# EAGLE design mini_exp_v1-1-0a (EAGLE 9.6.2)
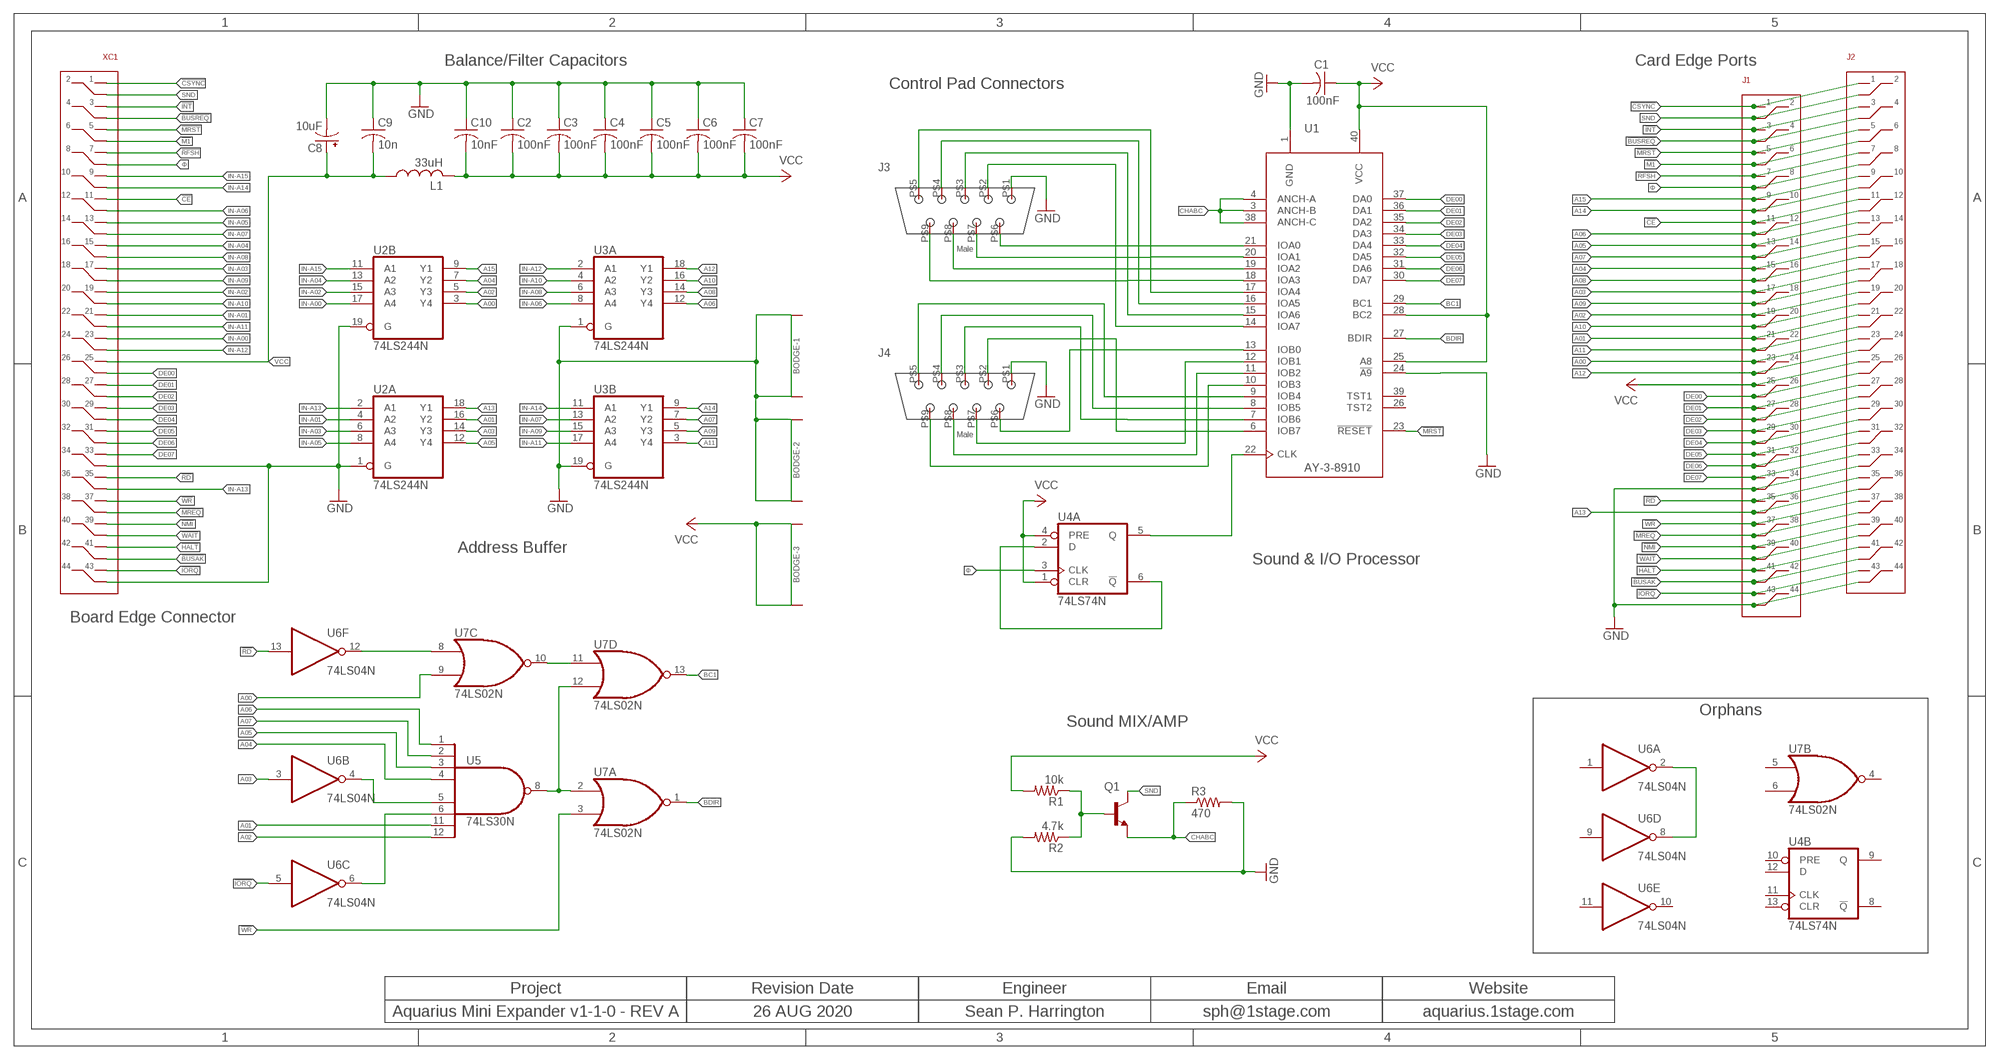
[diagram p0: schematic, sheet 1]

## Parts
C1  100nF  C-US050-025X095  [C050-025X095]
C2  100nF  C-US050-025X095  [C050-025X095]
C3  100nF  C-US050-025X095  [C050-025X095]
C4  100nF  C-US050-025X095  [C050-025X095]
C5  100nF  C-US050-025X095  [C050-025X095]
C6  100nF  C-US050-025X095  [C050-025X095]
C7  100nF  C-US050-025X095  [C050-025X095]
C8  10uF  CPOL-USE22-6AXIAL  [E22-6]
C9  10n  C-US075-032X103  [C075-032X103]
C10  10nF  C-US075-032X103  [C075-032X103]
J1  CR22A-44D-2.54DS(70)STRAIGHT  [CR22A-44D-2.54DS(70)]
J2  CR22A-44D-2.54DS(70)STRAIGHT  [CR22A-44D-2.54DS(70)]
J3  DB9-MALE-RA  [DB9-MALE-RA]
J4  DB9-MALE-RA  [DB9-MALE-RA]
L1  33uH  L-US0204/5  [0204/5]
Q1  -NPN-TO92L  [TO92L]
R1  10k  R-US_0207/7  [0207/7]
R2  4.7k  R-US_0207/7  [0207/7]
R3  470  R-US_0207/7  [0207/7]
U1  AY-3-8910  RAD38910DIL40-6  [RAD38910-DIL40-6]
U2  74LS244N  [DIL20]
U3  74LS244N  [DIL20]
U4  74LS74N  [DIL14]
U5  74LS30N  [DIL14]
U6  74LS04N  [DIL14]
U7  74LS02N  [DIL14]
XC1  AQ-CART-EDGE  [AQ-CART-EDGE]
XX01  AQ-MX-BODGE-1  [AQ-MX-BODGE-1]
XX02  AQ-MX-BODGE-2  [AQ-MX-BODGE-2]
XX03  AQ-MX-BODGE-3  [AQ-MX-BODGE-3]

## Nets
!BUSAK: J1.P$42(X42) J2.P$42(X42) XC1.P$42(X42)
!BUSREQ: J1.P$4(X4) J2.P$4(X4) XC1.P$4(X4)
!CE: J1.P$11(X11) J2.P$11(X11) XC1.P$11(X11)
!CSYNC: J1.P$1(X1) J2.P$1(X1) XC1.P$1(X1)
!HALT: J1.P$41(X41) J2.P$41(X41) XC1.P$41(X41)
!INT: J1.P$3(X3) J2.P$3(X3) XC1.P$3(X3)
!IORQ: J1.P$43(X43) J2.P$43(X43) U6.5(C:I) XC1.P$43(X43)
!M1: J1.P$6(X6) J2.P$6(X6) XC1.P$6(X6)
!MREQ: J1.P$38(X38) J2.P$38(X38) XC1.P$38(X38)
!MRST: J1.P$5(X5) J2.P$5(X5) U1.23(!RESET) XC1.P$5(X5)
!NMI: J1.P$39(X39) J2.P$39(X39) XC1.P$39(X39)
!RD: J1.P$35(X35) J2.P$35(X35) U6.13(F:I) XC1.P$35(X35)
!RFSH: J1.P$7(X7) J2.P$7(X7) XC1.P$7(X7)
!WAIT: J1.P$40(X40) J2.P$40(X40) XC1.P$40(X40)
!WR: J1.P$37(X37) J2.P$37(X37) U7.3(A:I1) XC1.P$37(X37)
A00: J1.P$23(X23) J2.P$23(X23) U2.3(B:Y4) U7.9(C:I1)
A01: J1.P$21(X21) J2.P$21(X21) U2.16(A:Y2) U5.11(I6)
A02: J1.P$19(X19) J2.P$19(X19) U2.5(B:Y3) U5.12(I7)
A03: J1.P$17(X17) J2.P$17(X17) U2.14(A:Y3) U6.3(B:I)
A04: J1.P$15(X15) J2.P$15(X15) U2.7(B:Y2) U5.4(I3)
A05: J1.P$13(X13) J2.P$13(X13) U2.12(A:Y4) U5.3(I2)
A06: J1.P$12(X12) J2.P$12(X12) U3.12(A:Y4) U5.1(I0)
A07: J1.P$14(X14) J2.P$14(X14) U3.7(B:Y2) U5.2(I1)
A08: J1.P$16(X16) J2.P$16(X16) U3.14(A:Y3)
A09: J1.P$18(X18) J2.P$18(X18) U3.5(B:Y3)
A10: J1.P$20(X20) J2.P$20(X20) U3.16(A:Y2)
A11: J1.P$22(X22) J2.P$22(X22) U3.3(B:Y4)
A12: J1.P$24(X24) J2.P$24(X24) U3.18(A:Y1)
A13: J1.P$36(X36) J2.P$36(X36) U2.18(A:Y1)
A14: J1.P$10(X10) J2.P$10(X10) U3.9(B:Y1)
A15: J1.P$9(X9) J2.P$9(X9) U2.9(B:Y1)
BC1: U1.29(BC1) U7.13(D:O)
BDIR: U1.27(BDIR) U7.1(A:O)
CHABC: Q1.1(E) R3.1 U1.3(ANCH-B) U1.4(ANCH-A) U1.38(ANCH-C)
DE00: J1.P$26(X26) J2.P$26(X26) U1.37(DA0) XC1.P$26(X26)
DE01: J1.P$27(X27) J2.P$27(X27) U1.36(DA1) XC1.P$27(X27)
DE02: J1.P$28(X28) J2.P$28(X28) U1.35(DA2) XC1.P$28(X28)
DE03: J1.P$29(X29) J2.P$29(X29) U1.34(DA3) XC1.P$29(X29)
DE04: J1.P$30(X30) J2.P$30(X30) U1.33(DA4) XC1.P$30(X30)
DE05: J1.P$31(X31) J2.P$31(X31) U1.32(DA5) XC1.P$31(X31)
DE06: J1.P$32(X32) J2.P$32(X32) U1.31(DA6) XC1.P$32(X32)
DE07: J1.P$33(X33) J2.P$33(X33) U1.30(DA7) XC1.P$33(X33)
GND: C1.2 C2.1 C3.1 C4.1 C5.1 C6.1 C7.1 C8.- C9.1 C10.1 J1.P$34(X34) J1.P$44(X44) J2.P$34(X34) J2.P$44(X44) J3.P$1 J4.P$1 R2.2 R3.2 U1.1(GND) U1.24(!A9) U2.1(A:G) U2.19(B:G) U3.1(A:G) U3.19(B:G) XC1.P$34(X34) XC1.P$44(X44) XX01.P$1 XX01.P$2 XX02.P$1 XX02.P$2
IN-A00: U2.17(B:A4) XC1.P$23(X23)
IN-A01: U2.4(A:A2) XC1.P$21(X21)
IN-A02: U2.15(B:A3) XC1.P$19(X19)
IN-A03: U2.6(A:A3) XC1.P$17(X17)
IN-A04: U2.13(B:A2) XC1.P$15(X15)
IN-A05: U2.8(A:A4) XC1.P$13(X13)
IN-A06: U3.8(A:A4) XC1.P$12(X12)
IN-A07: U3.13(B:A2) XC1.P$14(X14)
IN-A08: U3.6(A:A3) XC1.P$16(X16)
IN-A09: U3.15(B:A3) XC1.P$18(X18)
IN-A10: U3.4(A:A2) XC1.P$20(X20)
IN-A11: U3.17(B:A4) XC1.P$22(X22)
IN-A12: U3.2(A:A1) XC1.P$24(X24)
IN-A13: U2.2(A:A1) XC1.P$36(X36)
IN-A14: U3.11(B:A1) XC1.P$10(X10)
IN-A15: U2.11(B:A1) XC1.P$9(X9)
N$5: Q1.2(B) R1.1 R2.1
N$6: U6.2(A:O) U6.8(D:O)
N$18: J4.P$6 U1.13(IOB0)
N$62: U7.10(C:O) U7.11(D:I0)
N$63: U4.2(A:D) U4.6(A:!Q)
N$89: U1.22(CLK) U4.5(A:Q)
N$90: U5.8(O) U7.2(A:I0) U7.12(D:I1)
N$91: U6.12(F:O) U7.8(C:I0)
N$92: U5.5(I4) U6.4(B:O)
N$93: U5.6(I5) U6.6(C:O)
N$94: J4.P$2 U1.6(IOB7)
N$95: J4.P$7 U1.12(IOB1)
N$96: J4.P$8 U1.11(IOB2)
N$98: J4.P$5 U1.9(IOB4)
N$99: J4.P$4 U1.8(IOB5)
N$100: J4.P$3 U1.7(IOB6)
N$101: J4.P$9 U1.10(IOB3)
N$102: J3.P$2 U1.14(IOA7)
N$103: J3.P$3 U1.15(IOA6)
N$104: J3.P$4 U1.16(IOA5)
N$105: J3.P$5 U1.17(IOA4)
N$106: J3.P$6 U1.21(IOA0)
N$107: J3.P$7 U1.20(IOA1)
N$108: J3.P$8 U1.19(IOA2)
N$109: J3.P$9 U1.18(IOA3)
SND: J1.P$2(X2) J2.P$2(X2) Q1.3(C) XC1.P$2(X2)
VCC: C1.1 C2.2 C3.2 C4.2 C5.2 C6.2 C7.2 C8.+ C9.2 C10.2 J1.P$25(X25) J2.P$25(X25) L1.1 L1.2 R1.2 U1.25(A8) U1.28(BC2) U1.40(VCC) U4.1(A:CLR) U4.4(A:PRE) XC1.P$25(X25) XX03.P$1 XX03.P$2
Φ: J1.P$8(X8) J2.P$8(X8) U4.3(A:CLK) XC1.P$8(X8)
Unconnected: U1.26(TST2) U1.39(TST1) U4.8(B:!Q) U4.9(B:Q) U4.10(B:PRE) U4.11(B:CLK) U4.12(B:D) U4.13(B:CLR) U6.1(A:I) U6.9(D:I) U6.10(E:O) U6.11(E:I) U7.4(B:O) U7.5(B:I0) U7.6(B:I1)

## Notes on the sheet
- Balance/Filter Capacitors | Card Edge Ports
- Control Pad Connectors
- Address Buffer
- Sound & I/O Processor
- Board Edge Connector
- Orphans
- Sound MIX/AMP
- Project | Revision Date | Engineer | Email | Website
- Aquarius Mini Expander v1-1-0 - REV A | 26 AUG 2020 | Sean P. Harrington | sph@1stage.com | aquarius.1stage.com

## Power pins joined to a net without a drawn wire
GND: U2.10(P:GND) U3.10(P:GND) U4.7(P:GND) U5.7(GND) U6.7(P:GND) U7.7(P:GND)
VCC: U2.20(P:VCC) U3.20(P:VCC) U4.14(P:VCC) U5.14(VCC) U6.14(P:VCC) U7.14(P:VCC)

## Library data of the parts
C1-C7 = aq-rcl:C-US: CAPACITOR, American symbol
C8 = aq-rcl:CPOL-US: POLARIZED CAPACITOR, American symbol; SPICEPREFIX: C
C9 C10 = aq-rcl:C-US: CAPACITOR, American symbol; SPICEPREFIX: C
J1 J2 = con-hirose-sph:CR22A-44D-2.54DS(70)
J3 J4 = aquarius:DB9-MALE-RA
L1 = aq-rcl:L-US: INDUCTOR, American symbol; SPICEPREFIX: L
Q1 = aq-transistor:*-NPN-: NPN Transistror BF959 corrected 2008.03.06
R1-R3 = aq-rcl:R-US_: RESISTOR, American symbol; SPICEPREFIX: R
U1 = aquarius:RAD38910
U2 U3 = 74xx-us:74*244: Octal BUFFER and LINE DRIVER, 3-state
U4 = 74xx-us:74*74: Dual D type positive edge triggered FLIP FLOP, preset and clear
U5 = 74xx-us:74*30: 8-input NAND gate
U6 = 74xx-us:74*04: Hex INVERTER
U7 = 74xx-us:74*02: Quad 2-input NOR gate
XC1 = aquarius:AQ-CART-EDGE
XX01 = aquarius:AQ-MX-BODGE-1
XX02 = aquarius:AQ-MX-BODGE-2
XX03 = aquarius:AQ-MX-BODGE-3

## Board
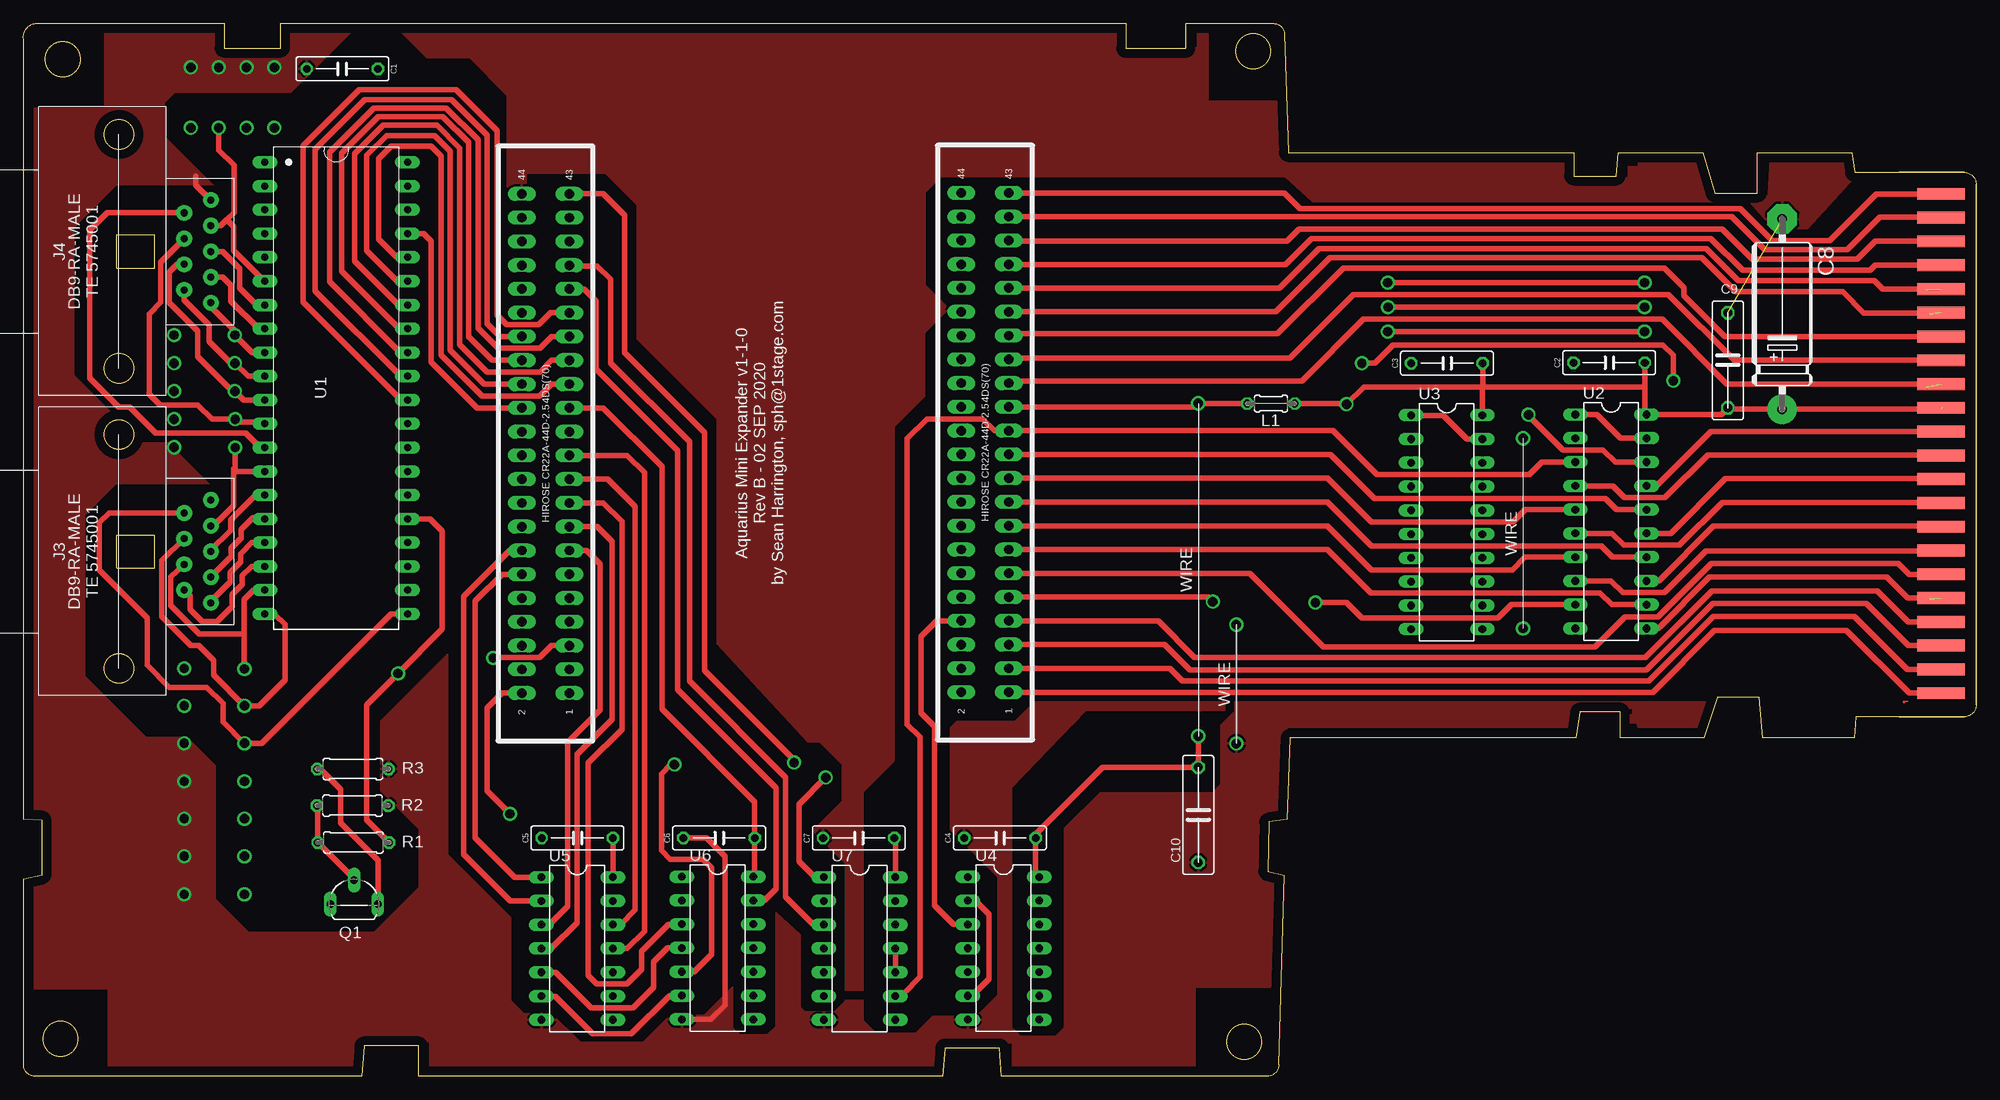
[diagram p1: board, top side]
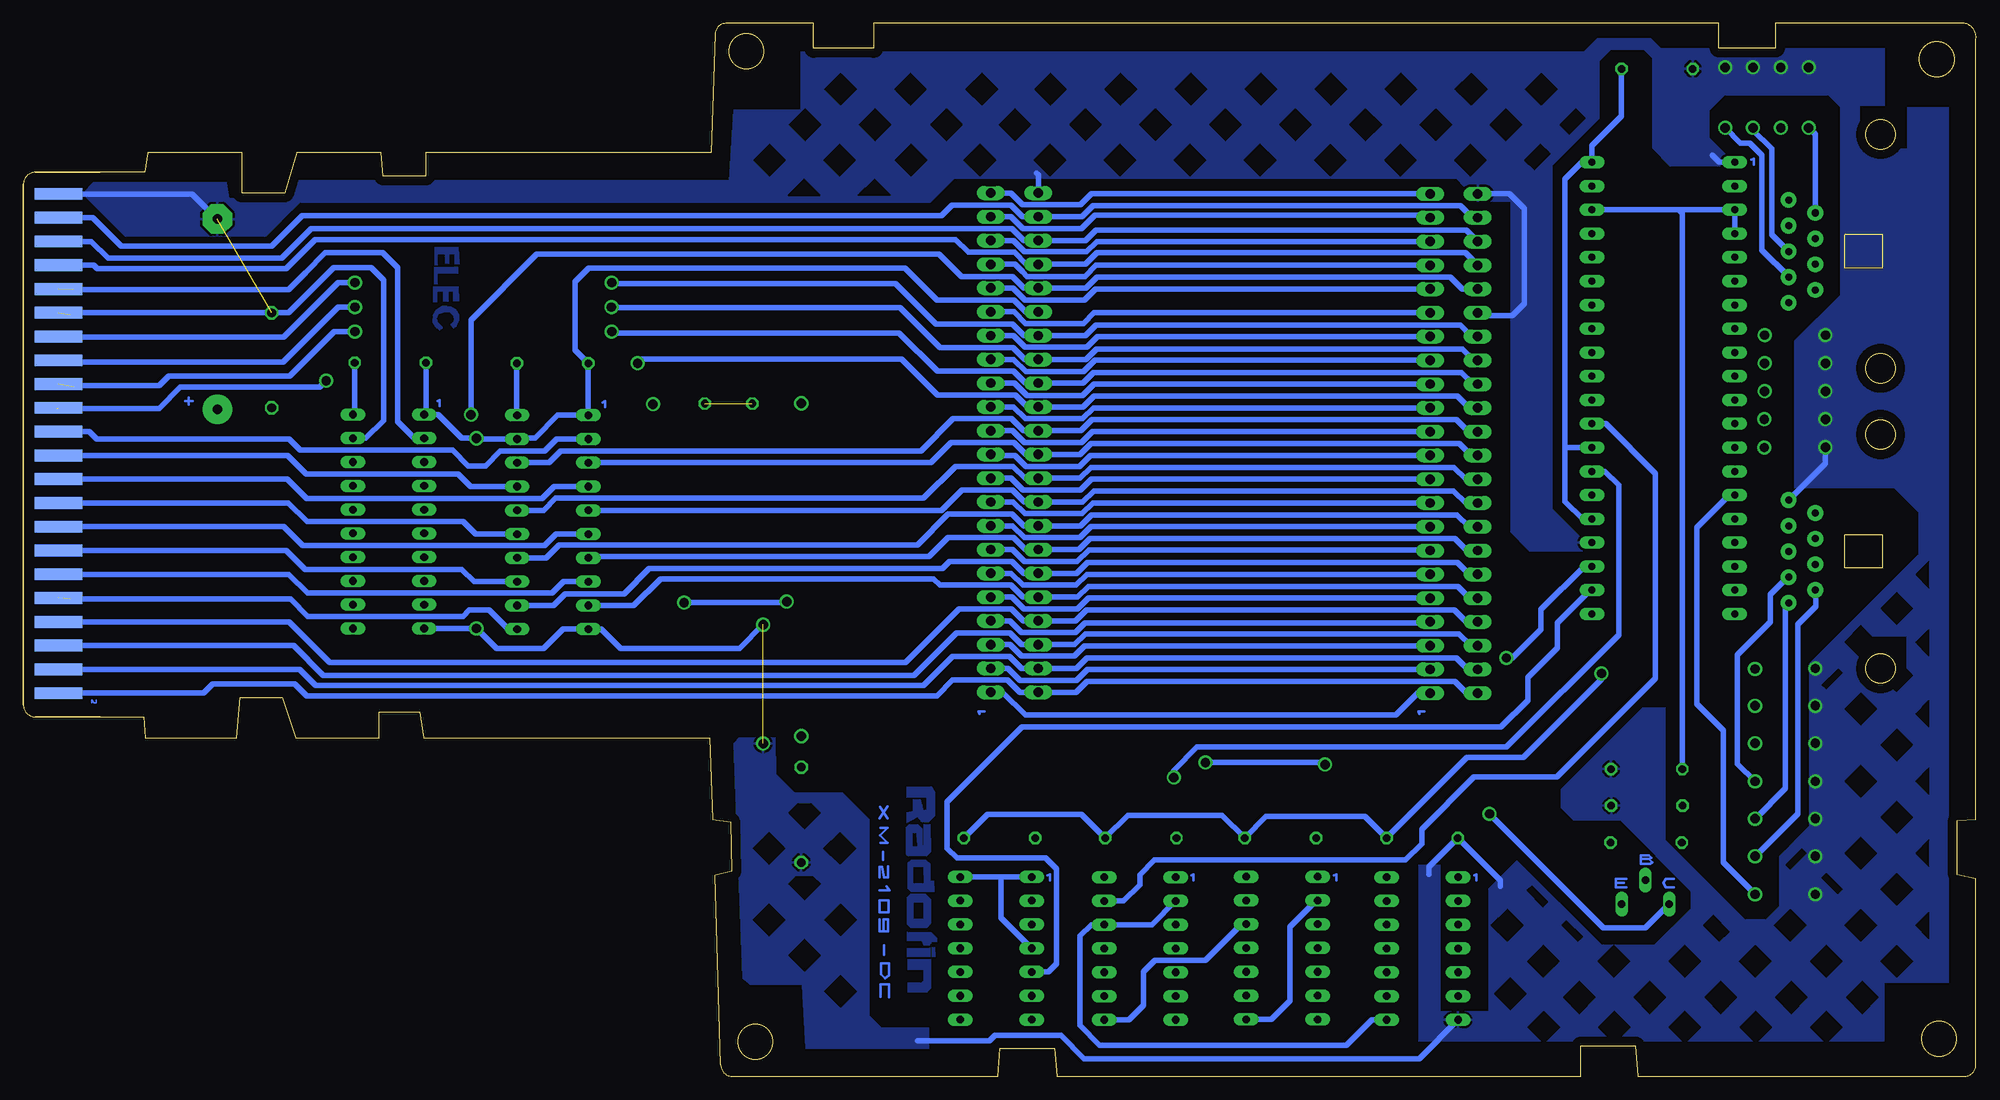
[diagram p2: board, bottom side, seen from below]

Size 208.57 x 112.5 mm. Coordinates in mm from the lower left corner, seen from the top.
Outline: 195.31,98.7 195.59,96.6 207.3,96.6 arc-90 208.57,95.33 208.57,39.67 arc-90 207.3,38.41 195.72,38.41 195.57,36.14 185.81,36.14 185.43,40.49 180.91,40.49 179.51,36.14 170.55,36.14 170.55,38.91 166.23,38.91 165.82,36.14 135.29,36.14 134.94,27.46 133.03,27.18 132.9,21.92 134.68,21.49 134.1,1.27 arc-90 132.83,0 104.46,0 104.28,3.02 98.44,3.02 98.16,0 42.2,0 42.2,3.25 36.38,3.25 36.13,0 1.28,0 arc-90 0.01,1.27 0.01,21.13 1.99,21.54 1.99,27.36 0.01,27.48 0.01,110.85 arc-90 1.28,112.5 21.42,112.5 21.42,109.86 27.47,109.86 27.47,112.5 117.77,112.5 117.77,109.83 124.17,109.83 124.17,112.5 133.44,112.5 arc-90 134.71,111.35 135.11,98.7 165.59,98.7 165.59,96.19 170.14,96.19 170.37,98.7 179.39,98.7 180.68,94.39 185.23,94.39 185.23,98.7 195.31,98.7
Outline: circle at 3.95,4.01 radius 1.86
Outline: circle at 4.2,108.66 radius 1.86
Outline: circle at 131.35,109.52 radius 1.86
Outline: circle at 130.39,3.71 radius 1.86
Outline: circle at 10.2,100.63 radius 1.57
Outline: circle at 10.2,75.64 radius 1.57
Outline: circle at 10.2,68.58 radius 1.57
Outline: circle at 10.2,43.59 radius 1.57
Copper layers (1*16): Top 0.035mm / dielectric 1.5mm / Bottom 0.035mm
Design rules "default": minimum track width 6mil, minimum drill 0.35mm, track to track 6mil, track to pad 6mil, pad to pad 6mil, via to via 6mil, smd to smd 6mil, copper to edge 40mil, drill to drill 6mil, minimum pad ring 10mil, minimum via ring 8mil, stop-mask expansion 4mil, vias tented up to drill 0mil, thermal gap 10mil

### Footprints (pad centres in the part's own frame; a part is rotated, then mirrored left to right if it is on the bottom)
C050-025X095 = drill 0.813 octagon: 1 -3.81,0; 2 3.81,0
E22-6 = drill 1.016 pad 3.15: + -11.43,0 | drill 1.016 pad 3.15 octagon: - 8.89,0
C075-032X103 = drill 0.914 octagon: 1 -5.08,0; 2 5.08,0
CR22A-44D-2.54DS(70) = drill 1 pad 1.422 long: P$1 -26.67,-2.54; P$2 -26.67,2.54; P$3 -24.13,-2.54; P$4 -24.13,2.54; P$5 -21.59,-2.54; P$6 -21.59,2.54; P$7 -19.05,-2.54; P$8 -19.05,2.54; P$9 -16.51,-2.54; P$10 -16.51,2.54; P$11 -13.97,-2.54; P$12 -13.97,2.54; P$13 -11.43,-2.54; P$14 -11.43,2.54; P$15 -8.89,-2.54; P$16 -8.89,2.54; P$17 -6.35,-2.54; P$18 -6.35,2.54; P$19 -3.81,-2.54; P$20 -3.81,2.54; P$21 -1.27,-2.54; P$22 -1.27,2.54; P$23 1.27,-2.54; P$24 1.27,2.54; P$25 3.81,-2.54; P$26 3.81,2.54; P$27 6.35,-2.54; P$28 6.35,2.54; P$29 8.89,-2.54; P$30 8.89,2.54; P$31 11.43,-2.54; P$32 11.43,2.54; P$33 13.97,-2.54; P$34 13.97,2.54; P$35 16.51,-2.54; P$36 16.51,2.54; P$37 19.05,-2.54; P$38 19.05,2.54; P$39 21.59,-2.54; P$40 21.59,2.54; P$41 24.13,-2.54; P$42 24.13,2.54; P$43 26.67,-2.54; P$44 26.67,2.54
DB9-MALE-RA = drill 0.75 pad 1.676: P$1 5.537,-9.83; P$2 2.794,-9.83; P$3 0.051,-9.83; P$4 -2.692,-9.83; P$5 -5.436,-9.83; P$6 4.166,-6.985; P$7 1.422,-6.985; P$8 -1.321,-6.985; P$9 -4.064,-6.985
0204/5 = drill 0.813 octagon: 1 -2.54,0; 2 2.54,0
TO92L = drill 0.813 long: 1 0,-2.54; 2 2.54,0; 3 0,2.54
0207/7 = drill 0.813 octagon: 1 -3.81,0; 2 3.81,0
RAD38910-DIL40-6 = drill 0.743 pad 1.343 long: 1 -7.62,24.13; 2 -7.62,21.59; 3 -7.62,19.05; 4 -7.62,16.51; 5 -7.62,13.97; 6 -7.62,11.43; 7 -7.62,8.89; 8 -7.62,6.35; 9 -7.62,3.81; 10 -7.62,1.27; 11 -7.62,-1.27; 12 -7.62,-3.81; 13 -7.62,-6.35; 14 -7.62,-8.89; 15 -7.62,-11.43; 16 -7.62,-13.97; 17 -7.62,-16.51; 18 -7.62,-19.05; 19 -7.62,-21.59; 20 -7.62,-24.13; 21 7.62,-24.13; 22 7.62,-21.59; 23 7.62,-19.05; 24 7.62,-16.51; 25 7.62,-13.97; 26 7.62,-11.43; 27 7.62,-8.89; 28 7.62,-6.35; 29 7.62,-3.81; 30 7.62,-1.27; 31 7.62,1.27; 32 7.62,3.81; 33 7.62,6.35; 34 7.62,8.89; 35 7.62,11.43; 36 7.62,13.97; 37 7.62,16.51; 38 7.62,19.05; 39 7.62,21.59; 40 7.62,24.13
DIL20 = drill 0.813 long: 1 -11.43,-3.81; 2 -8.89,-3.81; 3 -6.35,-3.81; 4 -3.81,-3.81; 5 -1.27,-3.81; 6 1.27,-3.81; 7 3.81,-3.81; 8 6.35,-3.81; 9 8.89,-3.81; 10 11.43,-3.81; 11 11.43,3.81; 12 8.89,3.81; 13 6.35,3.81; 14 3.81,3.81; 15 1.27,3.81; 16 -1.27,3.81; 17 -3.81,3.81; 18 -6.35,3.81; 19 -8.89,3.81; 20 -11.43,3.81
DIL14 = drill 0.813 long: 1 -7.62,-3.81; 2 -5.08,-3.81; 3 -2.54,-3.81; 4 0,-3.81; 5 2.54,-3.81; 6 5.08,-3.81; 7 7.62,-3.81; 8 7.62,3.81; 9 5.08,3.81; 10 2.54,3.81; 11 0,3.81; 12 -2.54,3.81; 13 -5.08,3.81; 14 -7.62,3.81
AQ-CART-EDGE = smd 5.08 x 1.27: P$1 -1.905,-26.67; P$3 -1.905,-24.13; P$5 -1.905,-21.59; P$7 -1.905,-19.05; P$9 -1.905,-16.51; P$11 -1.905,-13.97; P$13 -1.905,-11.43; P$15 -1.905,-8.89; P$17 -1.905,-6.35; P$19 -1.905,-3.81; P$21 -1.905,-1.27; P$23 -1.905,1.27; P$25 -1.905,3.81; P$27 -1.905,6.35; P$29 -1.905,8.89; P$31 -1.905,11.43; P$33 -1.905,13.97; P$35 -1.905,16.51; P$37 -1.905,19.05; P$39 -1.905,21.59; P$41 -1.905,24.13; P$43 -1.905,26.67 | smd 5.08 x 1.27 bottom: P$2 -1.905,-26.67; P$4 -1.905,-24.13; P$6 -1.905,-21.59; P$8 -1.905,-19.05; P$10 -1.905,-16.51; P$12 -1.905,-13.97; P$14 -1.905,-11.43; P$16 -1.905,-8.89; P$18 -1.905,-6.35; P$20 -1.905,-3.81; P$22 -1.905,-1.27; P$24 -1.905,1.27; P$26 -1.905,3.81; P$28 -1.905,6.35; P$30 -1.905,8.89; P$32 -1.905,11.43; P$34 -1.905,13.97; P$36 -1.905,16.51; P$38 -1.905,19.05; P$40 -1.905,21.59; P$42 -1.905,24.13; P$44 -1.905,26.67
AQ-MX-BODGE-1 = drill 1 pad 1.295: P$1 0,10.16; P$2 0,-10.16
AQ-MX-BODGE-2 = drill 1 pad 1.295: P$1 0,7.62; P$2 0,-5.08
AQ-MX-BODGE-3 = drill 1 pad 1.295: P$1 0,17.78; P$2 0,-17.78

### Placement (x,y rotation side)
C1  34.07,107.65 180 top
C2  169.38,76.25 0 top
C3  152.06,76.2 0 top
C4  104.3,25.48 0 top
C5  59.17,25.48 0 top
C6  74.31,25.48 0 top
C7  89.22,25.48 0 top
C8  187.87,82.7 90 top
C9  182.05,76.5 270 top
C10  125.49,27.94 90 top
J1  102.7,67.72 90 top
J2  55.76,67.61 90 top
J3  10.2,56.03 90 top
J4  10.2,88.09 90 top
L1  133.26,71.88 180 top
Q1  35.32,18.41 90 top
R1  35.24,24.99 0 top
R2  35.16,28.93 0 top
R3  35.19,32.84 0 top
U1  33.41,73.53 0 top
U2  169.58,59.28 270 top
U3  152.03,59.21 270 top
U4  104.68,13.69 270 top
U5  59.14,13.67 270 top
U6  74.15,13.72 270 top
U7  89.32,13.67 270 top
XC1  206.74,67.61 0 top
XX01  160.18,58.01 0 top
XX02  129.55,40.64 0 top
XX03  125.49,54.13 0 top

### Tracks (layer width: path | path; a pad name or v marks a point on that pad's centre or on a via)
!BUSAK
  Bottom 0.61: J2.P$42 53.81,91.75 55.08,93.02 94.32,93.02 95.49,91.85 J1.P$42 101.87,91.85 103.11,93.09 109.36,93.09 110.5,91.95 178.78,91.95 182.03,88.7 198.11,88.7 201.15,91.75 XC1.P$42
!BUSREQ
  Bottom 0.61: J2.P$4 54.27,43.48 55.51,44.73 94.96,44.73 96.1,43.59 J1.P$4 101.97,43.59 103.24,44.86 109.33,44.86 112.43,41.76 177.35,41.76 179.08,43.48 XC1.P$4
!CE
  Top 0.61: XC1.P$11 201.41,53.65 200.24,54.81 180.28,54.81 174.57,49.1 171.03,49.1 167.83,45.9 138.87,45.9 131.02,53.75 J1.P$11
  Bottom 0.61: J1.P$11 103.06,53.75 101.79,52.48 96.13,52.48 94.96,53.65 J2.P$11
!CSYNC
  Top 0.61: J1.P$1 174.04,41.05 180.61,47.62 194.73,47.62 201.41,40.95 XC1.P$1
  Bottom 0.61: J2.P$1 59.63,40.95 61.96,38.61 101.54,38.61 103.97,41.05 J1.P$1
!HALT
  Top 0.61: XC1.P$41 204.15,91.8 198.28,91.8 194.8,88.32 186.02,88.32 182.49,91.85 J1.P$41
  Bottom 0.61: J2.P$41 58.58,92.02 94.12,92.02 95.57,90.58 101.81,90.58 103.08,91.85 J1.P$41
!INT
  Top 0.61: XC1.P$3 201.2,43.48 195.57,49.12 180.53,49.12 173.63,42.23 123.82,42.23 122.46,43.59 J1.P$3
  Bottom 0.61: J1.P$3 103.39,43.59 102.12,42.32 96.1,42.32 94.93,43.48 J2.P$3
!IORQ  (via drill 1 pad 1.3)
  Top 0.61: XC1.P$43 204.18,94.26 197.9,94.26 192.92,89.28 186.83,89.28 183.4,92.71 136.36,92.71 134.68,94.39 J1.P$43 | J2.P$43 61.94,94.28 64.22,92 64.22,77.34 72.78,68.78 72.78,43.36 82.31,33.83 v82.31,33.53 | v69.53,33.33 69.15,33.33 68.16,32.33 68.16,24.13 69.1,23.19 72.6,23.19 73.52,22.28 73.52,13.06 71.64,11.18 U6.5
  Bottom 0.61: v82.31,33.53 69.73,33.53 v69.53,33.33 | J2.P$43 94.5,94.28 95.67,93.12 101.84,93.12 103.11,94.39 J1.P$43
!M1
  Bottom 0.61: J2.P$6 53.99,46.02 55.23,47.27 95.13,47.27 96.28,46.13 J1.P$6 101.94,46.13 103.21,47.4 108.9,47.4 113.45,42.85 176.54,42.85 179.72,46.02 XC1.P$6
!MREQ
  Bottom 0.61: J2.P$38 54.55,87.99 93.92,87.99 95.13,86.77 J1.P$38 101.46,86.77 102.73,88.04 107.63,88.04 109,89.41 177.41,89.41 180.53,86.28 200.7,86.28 201.08,86.67 XC1.P$38
!MRST  (via drill 1 pad 1.3)
  Top 0.61: XC1.P$5 201.33,46.02 196.84,50.52 180.45,50.52 173.34,43.41 124.6,43.41 121.88,46.13 J1.P$5 | J2.P$5 56.4,46.02 55.15,44.78 50.25,44.78 v50.18,44.7
  Bottom 0.61: U1.23 41.85,54.48 46.47,49.86 46.47,47.75 49.52,44.7 v50.18,44.7 | J1.P$5 103.19,46.13 101.97,44.91 96.33,44.91 95.24,46 58.33,46 J2.P$5
!NMI
  Top 0.61: J1.P$39 105.29,89.26 134.96,89.26 136.23,90.53 181.44,90.53 184.67,87.3 195.9,87.3 197.83,89.23 204.18,89.23 XC1.P$39
  Bottom 0.61: J2.P$39 93.92,89.2 95.02,88.09 101.62,88.09 102.83,89.31 J1.P$39
!RD
  Top 0.61: XC1.P$35 198.6,84.12 197.71,85.01 183.17,85.01 179.74,88.44 138.39,88.44 134.15,84.2 105.27,84.2 J1.P$35 | J2.P$35 59.88,84.12 61.15,82.86 61.15,75.59 69.86,66.88 69.86,41.35 80.38,30.84 80.38,20.02 79.16,18.8 U6.13
  Bottom 0.61: J2.P$35 94.04,84.12 95.24,82.93 101.59,82.93 102.88,84.23 J1.P$35
!RFSH
  Top 0.61: XC1.P$7 201.33,48.56 198.03,51.87 180.35,51.87 173.26,44.78 125.11,44.78 121.22,48.67 J1.P$7
  Bottom 0.61: J1.P$7 103.19,48.67 101.97,47.45 96.18,47.45 95.16,48.46 58.41,48.46 J2.P$7
!WAIT
  Bottom 0.61: J2.P$40 54.44,90.42 93.99,90.42 95.11,89.31 J1.P$40 101.69,89.31 102.96,90.58 177.84,90.58 180.99,87.43 199.53,87.43 201.31,89.2 XC1.P$40
!WR
  Top 0.61: XC1.P$37 197.83,86.67 197.29,86.13 183.64,86.13 180.26,89.51 137.55,89.51 134.78,86.74 105.27,86.74 J1.P$37 | J2.P$37 58.38,86.59 61.3,86.59 62.72,85.17 62.72,76.22 71.13,67.82 71.13,42.24 81.42,31.95 81.42,19.2 84.42,16.2 U7.3
  Bottom 0.61: J2.P$37 93.99,86.67 95.19,85.47 101.38,85.47 101.87,85.95 101.87,86 102.63,86.77 J1.P$37
A00
  Top 0.61: U2.3 162.17,65.63 160.84,64.31 144.56,64.31 139.89,68.99 J1.P$23 103.72,68.99 102.46,70.25 96.5,70.25 94.4,68.15 94.4,37.62 95.77,36.25 95.77,10.62 94.04,8.89 93.43,8.89 U7.9
  Bottom 0.61: J2.P$23 94.4,68.89 95.57,67.72 101.64,67.72 102.91,68.99 J1.P$23
A01
  Top 0.61: U2.16 170.17,60.55 168.97,61.75 144.28,61.75 139.58,66.45 J1.P$21 | J2.P$21 64.48,66.34 66.33,64.49 66.33,15.49 64.5,13.66 U5.11
  Bottom 0.61: J1.P$21 105.12,66.32 102.65,66.32 101.48,65.15 95.79,65.15 94.6,66.34 J2.P$21
A02
  Top 0.61: J2.P$19 62.39,63.8 65.34,60.86 65.34,17.78 63.77,16.2 U5.12 | U2.5 160.44,60.55 159.12,59.23 143.98,59.23 139.31,63.91 J1.P$19
  Bottom 0.61: J2.P$19 94.47,63.8 95.64,62.64 101.79,62.64 103.06,63.91 J1.P$19
A03
  Top 0.61: U2.14 169.73,55.47 168.54,56.67 144,56.67 139.31,61.37 J1.P$17 | J2.P$17 61.94,61.27 63.94,59.26 63.94,37.08 60.34,33.48 60.34,10.79 61.25,9.88 64.5,9.88 66.05,11.43 66.05,13.39 68.92,16.26 U6.3
  Bottom 0.61: J2.P$17 94.35,61.27 95.49,60.12 101.61,60.12 102.86,61.37 J1.P$17
A04
  Top 0.61: U2.7 160.39,55.47 159.04,54.13 144,54.13 139.31,58.83 J1.P$15 | J2.P$15 61.28,58.73 62.88,57.12 62.88,38.12 59.14,34.39 59.14,16.43 56.37,13.66 U5.4
  Bottom 0.61: J2.P$15 58.33,58.75 94.52,58.75 95.72,57.56 101.64,57.56 102.91,58.83 J1.P$15
A05
  Top 0.61: U2.12 169.66,50.39 168.39,51.66 143.93,51.66 139.31,56.29 J1.P$13 | J2.P$13 60.16,56.19 61.58,54.76 61.58,39.13 58.15,35.7 58.15,18.19 56.17,16.2 U5.3
  Bottom 0.61: J1.P$13 102.93,56.29 101.66,55.02 96.02,55.02 94.78,56.26 58.38,56.26 J2.P$13
A06
  Top 0.61: U5.1 52.49,21.29 48.27,25.5 48.27,50.8 51.12,53.65 J2.P$12
  Bottom 0.61: U3.12 151.93,50.32 150.68,51.56 144.41,51.56 141.72,54.25 110.4,54.25 109.64,55.02 102.98,55.02 101.71,53.75 J1.P$12 96.07,53.75 94.91,54.91 55.38,54.91 54.11,53.65 J2.P$12
A07
  Top 0.61: U5.2 52.01,18.75 47,23.75 47,51.26 51.93,56.19 J2.P$14
  Bottom 0.61: J2.P$14 54.39,56.19 55.69,57.48 94.64,57.48 95.83,56.29 J1.P$14 101.54,56.29 102.81,57.56 109.82,57.56 111.85,55.52 148.09,55.52 U3.7
A08
  Bottom 0.61: J2.P$16 54.16,58.73 55.43,59.99 94.5,59.99 95.67,58.83 J1.P$16 101.69,58.83 102.96,60.1 109.79,60.1 113.09,56.79 151.34,56.79 152.74,55.4 U3.14
A09
  Bottom 0.61: J2.P$18 54.52,61.27 55.82,62.56 94.25,62.56 95.44,61.37 J1.P$18 101.66,61.37 102.93,62.64 108.33,62.64 110.49,60.48 U3.5
A10
  Bottom 0.61: J2.P$20 54.52,63.8 55.79,65.08 94.52,65.08 95.69,63.91 J1.P$20 101.61,63.91 102.88,65.18 109,65.18 112.41,61.77 151.7,61.77 153,60.48 U3.16
A11
  Bottom 0.61: J2.P$22 53.91,66.34 55.18,67.61 94.55,67.61 95.72,66.45 J1.P$22 101.48,66.45 102.75,67.72 109.49,67.72 111.64,65.56 U3.3
A12
  Bottom 0.61: J2.P$24 54.24,68.89 55.51,70.16 94.45,70.16 95.62,68.99 J1.P$24 101.74,68.99 103.01,70.26 109.26,70.26 112.71,66.8 151.17,66.8 152.41,65.56 U3.18
A13  (via drill 1 pad 1.3)
  Top 0.61: U2.18 170.01,65.63 168.72,66.93 164.45,66.93 160.77,70.61 v160.77,70.69
  Bottom 0.61: J2.P$36 54.88,84.12 56.15,85.39 93.89,85.39 95.06,84.23 J1.P$36 101.69,84.23 102.93,85.47 108.39,85.47 110.76,87.83 153.73,87.83 160.77,80.8 v160.77,70.69
A14
  Bottom 0.61: J2.P$10 54.11,51.1 55.36,52.35 94.83,52.35 95.97,51.21 J1.P$10 101.79,51.21 103.06,52.48 110.65,52.48 111.34,53.16 140.52,53.16 143.37,50.32 U3.9
A15  (via drill 1 pad 1.3)
  Top 0.61: J1.P$9 126.55,51.21 v127.04,50.72 | U2.9 158.94,50.39 157.52,48.97 142.99,48.97 141.34,50.62 v138.01,50.62
  Bottom 0.61: v138.01,50.62 127.14,50.62 v127.04,50.72 | J1.P$9 102.96,51.21 101.71,49.96 95.97,49.96 94.83,51.1 J2.P$9
BC1
  Bottom 0.61: U7.13 91.05,18.75 89.32,20.47 89.32,21.54 87.74,23.11 60.97,23.11 59.22,24.87 59.22,26.42 53.63,32 44.77,32 34.25,42.52 34.25,64.41 39.56,69.72 U1.29
BDIR  (via drill 1 pad 1.3)
  Top 0.61: U7.1 84.54,21.29 82.84,22.99 82.84,29.08 v85.69,31.93
  Bottom 0.61: v85.69,31.93 85.69,32.72 83.22,35.18 50.15,35.18 38.16,47.17 38.16,63.17 39.64,64.64 U1.27
CHABC
  Top 0.61: R3.1 31.71,32.84 33.87,30.68 33.87,27.1 37.88,23.09 37.88,18.44 Q1.1
  Bottom 0.61: U1.38 31.76,92.58 | 31.76,92.58 U1.3 U1.4 | R3.1 31.38,92.2 31.76,92.58
DE00  (via drill 1 pad 1.3)  (1 unrouted)
  Top 0.61: U1.37 42.76,90.04 43.57,89.23 43.57,76.3 48.47,71.4 53.2,71.4 J2.P$26 | v142.96,76.2 144.36,76.2 146.3,78.14 175.13,78.14 176.24,77.04 v176.24,74.32
  Bottom 0.61: v142.96,76.2 142.51,76.66 114.79,76.66 110.93,72.8 102.6,72.8 101.33,71.53 J1.P$26 95.41,71.53 94.25,72.69 55.38,72.69 54.11,71.42 J2.P$26 | v176.24,74.32 176.92,73.64 191.81,73.64 194.07,71.37 204.99,71.37
DE01
  Top 0.61: XC1.P$27 181.95,73.97 175.03,80.89 143.13,80.89 136.54,74.3 105.47,74.3 J1.P$27 | U1.36 39.89,87.5 37.93,89.46 37.93,98.07 39.25,99.39 43.55,99.39 44.61,98.32 44.61,77.06 48.97,72.7 55.16,72.7 56.42,73.97 J2.P$27
  Bottom 0.61: J2.P$27 94.25,73.97 95.47,72.74 101.37,72.74 102.7,74.07 J1.P$27
DE02  (via drill 1 pad 1.3)  (1 unrouted)
  Top 0.61: U1.35 39.94,84.96 36.69,88.21 36.69,98.4 38.8,100.51 43.93,100.51 45.58,98.86 45.58,77.62 49.24,73.97 J2.P$28 | v173.16,79.58 v145.73,79.58
  Bottom 0.61: v173.16,79.58 175.37,79.58 180.15,74.8 193.05,74.8 194.04,73.81 203.06,73.81 203.21,73.66 | 142.25,79.43 115.02,79.43 110.93,75.34 102.83,75.34 101.56,74.07 J1.P$28 95.41,74.07 94.27,75.21 54.95,75.21 53.71,73.97 J2.P$28 | 142.25,79.43 142.43,79.43 | v145.73,79.58 145.58,79.43 142.25,79.43
DE03
  Top 0.61: XC1.P$29 182.74,76.5 175.72,83.53 142.03,83.53 135.27,76.76 105.4,76.76 J1.P$29 | U1.34 40.07,82.42 35.39,87.1 35.39,98.58 38.42,101.6 44.18,101.6 46.6,99.19 46.6,78.21 49.55,75.25 55.17,75.25 56.42,76.5 J2.P$29
  Bottom 0.61: J2.P$29 94.09,76.5 95.32,75.28 101.5,75.28 102.83,76.61 J1.P$29
DE04  (via drill 1 pad 1.3)
  Top 0.61: U1.33 40.14,79.88 33.97,86.06 33.97,98.63 37.88,102.54 44.79,102.54 47.53,99.8 47.53,79.05 50.07,76.5 J2.P$30 | v145.76,82.19 v173.16,82.19
  Bottom 0.61: v173.16,82.19 174.97,82.19 180.83,76.33 204.02,76.33 XC1.P$30 | 145.71,82.14 v145.76,82.19 145.71,82.14 | J2.P$30 53.66,76.5 54.88,77.72 93.97,77.72 95.08,76.61 J1.P$30 101.59,76.61 102.86,77.88 110.68,77.88 114.95,82.14 145.71,82.14
DE05
  Top 0.61: XC1.P$31 181.75,79.05 177.35,83.44 177.35,84.28 175.27,86.36 140.98,86.36 133.97,79.35 105.45,79.35 J1.P$31 | U1.32 40.25,77.34 32.7,84.89 32.7,98.73 37.4,103.43 45.17,103.43 48.55,100.05 48.55,79.93 50.7,77.78 55.17,77.78 56.4,79.02 58.28,79.02 J2.P$31
  Bottom 0.61: J2.P$31 93.84,79.05 94.96,77.93 101.61,77.93 102.83,79.15 J1.P$31
DE06  (via drill 1 pad 1.3)
  Top 0.61: J2.P$32 50.92,79.05 49.54,80.43 49.54,100.56 45.73,104.37 36.46,104.37 31.15,99.06 31.15,83.92 40.27,74.8 U1.31 | v145.73,84.81 v173.16,84.81
  Bottom 0.61: 145.6,84.68 v145.73,84.81 145.6,84.68 | v173.16,84.81 174.94,84.81 180.78,78.97 204.13,78.97 XC1.P$32 | J2.P$32 53.88,79.05 55.1,80.26 93.99,80.26 95.11,79.15 J1.P$32 101.69,79.15 102.91,80.37 111.09,80.37 115.4,84.68 145.6,84.68
DE07
  Top 0.61: XC1.P$33 204.18,81.56 196.58,81.56 194.32,83.82 182.89,83.82 179.26,87.45 139.53,87.45 133.77,81.69 J1.P$33 | J2.P$33 58.28,81.61 56.32,81.61 55.05,80.33 51.6,80.33 50.61,81.33 50.61,101.03 46.2,105.44 35.87,105.44 29.88,99.45 29.88,82.7 40.32,72.26 U1.30
  Bottom 0.61: J2.P$33 94.19,81.58 95.34,80.44 101.51,80.44 102.75,81.69 J1.P$33
GND  (via drill 1 pad 1.3)  (3 unrouted)
  Top 0.61: U2.1 168.06,70.71 170.6,68.17 U2.19 | U3.19 154.16,68.1 151.65,70.61 148.25,70.61 U3.1 | C6.1 72.96,25.48 74.94,23.5 74.94,7.62 73.42,6.1 U6.7 | J4.P$1 18.43,95.22 18.43,96.16
  Bottom 0.61: J1.P$44 100.16,96.34 100.34,96.52 | U5.7 59.47,1.91 91.98,1.91 95.27,1.91 97.77,4.4 104.81,4.4 105.4,3.81 113.07,3.81 | J3.P$1 16.09,65.46 v16.09,67.21 | U1.1 27.44,97.66 28.18,98.4 | U2.19 171.99,68.17 170.12,70.05 170.12,85.06 171.44,86.39 175.45,86.39 180.25,81.58 C9.1 203.39,81.58 203.57,81.41 | J1.P$34 101.54,81.69 102.78,82.93 110.98,82.93 114.39,86.33 148.22,86.33 149.64,84.91 149.64,77.6 C3.1 148.25,70.66 U3.1 151.5,70.64 153.94,68.2 155.94,68.2 U3.19 160.11,68.1 XX01.P$1 161.76,68.17 164.3,70.71 U2.1 165.57,70.92 C2.1 | 157.49,45.72 153,45.72 150.94,47.78 U3.10 146.85,47.78 144.79,45.72 132.09,45.72 XX02.P$1 | 157.49,45.72 157.97,45.72 | U2.10 165.64,47.98 165.52,47.85 XX01.P$2 158.05,45.72 157.49,45.72 | J2.P$34 52.92,81.28 49.54,81.28 48.27,82.55 48.27,92.71 49.85,94.28 J2.P$44 | XC1.P$44 204.18,94.26 190.54,94.26 C8.- | 58.43,21.59 58.43,22.4 C5.1 50.81,20.93 50.81,20.32
  other vias: 17.18,35.59 17.18,31.52 17.18,27.53 17.18,23.52 17.18,19.46 17.89,107.8 20.86,107.8 23.84,107.8 26.81,107.8 16.09,70.21 16.09,73.2 16.09,76.2 16.09,79.2 17.18,43.59 17.18,39.6
  pour Top: 2.07,28.45 0.94,28.45 0.94,103.48 8.69,103.48 8.69,112.53 20.85,112.53 20.85,110.06 28.46,110.06 28.46,112.44 117.27,112.44 117.27,109.97 125.42,109.97 125.42,112.62 126.5,112.62 126.5,104.25 134.34,104.25 134.61,98.39 164.96,98.39 164.96,96.05 171.45,96.05 171.45,97.22 172.48,97.22 172.48,98.3 179.1,98.3 180.32,94.16 186.4,94.16 186.58,98.14 194.8,98.14 194.8,96 195.59,96 190.54,90.51 186.92,90.51 184.42,93.39 137.72,93.39 134.79,96.05 97.95,96.05 96.31,94.41 96.31,84.57 98.86,82.01 96.24,79.39 96.24,72.63 93,69.39 93,33.68 89.67,30.35 89.67,9.14 87.82,9.14 87.82,22.71 84.3,26.21 87.52,29.43 87.52,33.27 85.11,35.67 83.79,35.67 74.1,46.18 74.1,70.23 65.54,78.79 65.54,93.08 62.18,96.44 53.71,96.44 53.71,95 51.68,95 51.68,104.79 47.71,108.77 43.1,108.77 39.96,111.9 35.36,111.9 28.55,105.09 16.11,105.09 15.03,104.01 15.03,100.45 20.26,95.22 9.9,95.22 5.36,90.67 5.36,74.93 12.58,67.71 15.43,67.71 19.84,63.3 9.84,63.3 6.53,59.99 6.53,42.78 13.06,36.26 17.42,36.26 20.47,33.21 20.47,18.94 23.99,15.43 37.51,15.43 42.26,20.18 42.26,26.38 38.13,30.51 38.13,37.98 45.31,45.16 45.31,23.73 52.05,17 52.05,8.13 53.41,6.77 56.39,6.77 59.47,3.69 66.24,3.69 69.14,6.59 72.77,6.59 75.73,9.55 75.73,5.21 76.47,4.48 79.5,4.48 80.37,5.35 80.37,17.54 82.95,15.2 82.95,7.45 83.43,6.97 86.68,6.97 87.82,8.1 87.82,8.2 89.67,8.2 89.67,6.02 91.04,4.65 95.34,4.65 97.15,6.46 101.87,6.46 104.1,8.7 104.1,21.25 99.02,26.33 99.02,37.28 99.7,37.96 105.97,37.96 108.06,40.06 128.28,40.06 128.28,39.04 113.45,39.04 105.54,30.81 105.54,5.24 106.43,4.35 110.31,4.35 111.19,5.23 111.19,26.53 115.02,30.36 127.06,30.36 127.93,31.23 127.93,37.53 129.42,39.04 129.42,40.06 179.92,40.06 178.92,37.01 172.53,37.01 172.36,37.71 171.58,37.71 171.58,38.67 171.91,38.67 171.91,39.24 165.19,39.24 165.19,37.23 134.97,37.23 134.52,28.32 132.67,27.64 132.31,20.98 133.98,20.52 133.71,9.45 125.15,9.45 125.15,0.89 105.65,0.89 105.65,3.55 97.81,3.55 97.81,1.07 43.41,1.07 43.41,3.64 35.71,3.64 35.71,0.89 9.05,0.89 9.05,9.31 1.17,9.31 1.17,20.84 2.07,20.84
  pour Bottom: 125.02,3.01 111.82,3.01 111.82,5.12 116.91,5.12 118.19,6.41 118.19,27.42 121.09,30.31 126.19,30.31 128.16,32.28 128.21,36.15 132.13,36.15 132.74,35.54 131.77,10.53 130.96,9.85 125.42,9.76
  pour Bottom: 9.82,10.06 2.91,10.06 2.91,103.5 7.35,103.5 7.35,99.08 12.4,99.08 12.4,103.74 9.76,103.74 9.76,109.8 33.65,109.8 34.73,110.88 40.47,110.88 41.91,109.44 125.56,109.44 125.56,103.22 132.73,103.22 133.18,95.72 179.72,95.72 180.68,93.8 186.56,93.8 186.86,95.51 201.11,95.51 202.25,94.31 197.7,89.77 182.71,89.77 179.06,93.42 111.67,93.42 109.13,95.96 55.51,95.96 54.7,95.09 53.74,93.53 49.75,93.53 49.75,58.19 47.71,56.15 42.04,56.15 42.04,57.37 45.24,60.56 45.24,97.36 40.24,102.35 40.24,108.49 39,109.74 35.52,109.74 34.58,108.81 34.58,99.2 32.69,97.31 26.5,97.31 26.5,98.25 28.5,100.25 28.5,103.2 26.84,104.86 15.81,104.86 14.53,103.59 14.53,83.44 19.42,78.55 19.42,62.9 8.74,62.9 6.14,60.29 6.14,55.74 17.83,44.05 17.83,26.69 21.04,23.48 21.04,18.1 22.43,16.71 24.69,16.71 33.17,25.19 33.17,39.39 35.57,39.39 44.34,30.63 44.34,28.74 42.99,27.4 38.02,27.4 30.47,19.85 30.47,17.87 34.34,13.99 39.99,13.99 49.04,23.05 52.09,20 52.09,6.88 57.22,6.88 57.22,22.55 59.56,22.55 59.56,3.79 9.82,3.79
IN-A00
  Top 0.61: U2.17 174.43,63.09 180.22,68.89 XC1.P$23
IN-A01
  Top 0.61: U2.4 169.76,63.09 171,61.85 175.35,61.85 179.89,66.4 204.15,66.4 XC1.P$21
IN-A02
  Top 0.61: XC1.P$19 204.15,63.86 181.8,63.86 175.96,58.01 U2.15
IN-A03
  Top 0.61: U2.6 169.68,58.01 170.93,56.77 176.9,56.77 181.44,61.32 204.15,61.32 XC1.P$17
IN-A04
  Top 0.61: XC1.P$15 204.13,58.8 180.53,58.8 174.66,52.93 U2.13
IN-A05
  Top 0.61: XC1.P$13 204.13,56.11 179.72,56.11 175.3,51.69 170.83,51.69 169.58,52.93 U2.8
IN-A06
  Bottom 0.61: U3.8 150.86,52.86 152.08,51.64 178.22,51.64 180.22,53.65 XC1.P$12
IN-A07
  Bottom 0.61: U3.13 160.44,52.86 161.76,54.18 178.5,54.18 180.5,56.19 XC1.P$14
IN-A08
  Bottom 0.61: U3.6 151.65,57.94 152.89,56.69 178.73,56.69 180.76,58.73 XC1.P$16
IN-A09
  Bottom 0.61: U3.15 160.29,57.94 161.61,59.26 178.27,59.26 180.28,61.27 XC1.P$18
IN-A10
  Bottom 0.61: U3.4 151.9,63.02 153.17,61.75 178.32,61.75 180.21,63.64 180.38,63.8 XC1.P$20
IN-A11
  Bottom 0.61: XC1.P$22 180.35,66.34 178.37,64.36 162.14,64.36 160.79,63.02 U3.17
IN-A12
  Bottom 0.61: U3.2 151.6,68.1 152.89,66.8 157.64,66.8 159.22,65.23 161.07,65.23 162.75,66.9 179.01,66.9 180.17,68.07 200.72,68.07 201.54,68.89 XC1.P$24
IN-A13  (1 unrouted)
  Bottom 0.61: U2.2 166.81,68.17 167.83,69.19 168.62,69.98 168.62,74.6 168.62,86.41 169.25,87.05 170.19,87.99 173.39,87.99 176.31,87.99 178.45,85.85 180.25,84.05 203.26,84.05
IN-A14  (1 unrouted)
  Bottom 0.61: U3.11 156.81,47.78 158.84,49.81 160.95,49.81 161.61,49.15 178.19,49.15 180.05,51 203.59,51
IN-A15
  Top 0.61: XC1.P$9 201.28,51.1 199.05,53.34 180.1,53.34 174.61,47.85 U2.11
N$1
  cutout Bottom: 80.18,99.98 78.46,101.69 80.18,103.4 81.89,101.69
N$2
  cutout Bottom: 46.45,107.18 44.74,105.47 46.45,103.76 48.16,105.47
N$3
  cutout Bottom: 102.64,99.98 100.92,101.69 102.64,103.4 104.35,101.69
N$4
  cutout Bottom: 65.2,99.98 63.49,101.69 65.2,103.4 66.92,101.69
N$5
  Top 0.61: R2.1 31.43,28.85 R1.1 35.32,21.11 Q1.2
N$6
  Bottom 0.61: U6.2 70.41,18.86 73.27,16 73.27,8.1 75.27,6.1 U6.8
N$7
  Bottom 0.254: 117.04,8.48 117.04,9.83
N$8
  cutout Bottom: 53.93,107.18 52.22,105.47 53.93,103.76 55.65,105.47
N$9
  cutout Bottom: 57.72,103.4 56,101.69 57.72,99.98 59.43,101.69
N$10
  cutout Bottom: 68.91,103.76 67.19,105.47 68.91,107.18 70.62,105.47
N$11
  cutout Bottom: 43.44,100.67 41.73,102.39 42.74,103.4 44.46,101.69
N$12
  cutout Bottom: 50.23,99.98 48.52,101.69 50.23,103.4 51.94,101.69
N$13
  cutout Bottom: 61.42,103.76 59.71,105.47 61.42,107.18 63.13,105.47
N$14
  Bottom 0.254: 117.11,16.76 117.11,15.49 116.72,15.49 | 116.72,15.49 116.22,15.49 116.22,16.76 116.72,16.76 116.72,15.49
N$15
  Bottom 0.254: 116.98,12.06 116.09,12.06 116.09,10.79 116.52,10.47 116.98,10.92 116.98,12.06
N$18  (via drill 1 pad 1.3)
  Top 0.61: J4.P$6 8.95,92.25 7.1,90.4 7.1,74.61 10.21,71.5 11.36,71.5 14.12,68.73 23.74,68.73 25.28,67.18 U1.13
  Bottom 0.61: J4.P$6 17.18,100.64 v17.89,101.35
N$19
  cutout Bottom: 128.88,96.19 127.16,97.91 128.88,99.62 130.59,97.91
N$20
  cutout Bottom: 123.49,94.1 123.46,94.12 125.17,95.84 126.88,94.12 126.86,94.1
N$23
  cutout Bottom: 72.69,99.98 70.98,101.69 72.69,103.4 74.4,101.69
N$24
  cutout Bottom: 76.47,96.19 74.76,97.91 76.47,99.62 78.18,97.91
N$25
  cutout Bottom: 47.18,96.85 45.47,98.56 46.53,99.62 48.24,97.91
N$26
  cutout Bottom: 117.61,99.98 115.89,101.69 117.61,103.4 119.32,101.69
N$27
  Bottom 0.254: 117.04,9.83 116.13,9.83
N$28
  Bottom 0.254: 116.13,9.83 116.13,8.47
N$29
  cutout Bottom: 54.01,96.19 52.3,97.91 54.01,99.62 55.73,97.91
N$30
  cutout Bottom: 68.99,99.62 67.27,97.91 68.99,96.19 70.7,97.91
N$31
  Bottom 0.254: 99.2,21.46 98.94,21.59 98.94,20.95
N$32
  Bottom 0.254: 83.83,21.46 83.58,21.59 83.58,20.95
N$33
  cutout Bottom: 83.96,96.19 82.25,97.91 83.96,99.62 85.67,97.91
N$34
  cutout Bottom: 61.5,96.19 59.79,97.91 61.5,99.62 63.21,97.91
N$35
  cutout Bottom: 121.39,96.19 119.68,97.91 121.39,99.62 123.1,97.91
N$36
  cutout Bottom: 76.39,103.76 74.68,105.47 76.39,107.18 78.11,105.47
N$37
  cutout Bottom: 125.09,99.98 123.38,101.69 125.09,103.4 126.81,101.69
N$38
  cutout Bottom: 106.42,96.19 104.7,97.91 106.42,99.62 108.13,97.91
N$39
  cutout Bottom: 91.44,96.19 89.73,97.91 91.44,99.62 93.16,97.91
N$40
  cutout Bottom: 83.88,103.76 82.17,105.47 83.88,107.18 85.59,105.47
N$41
  Bottom 0.254: 68.59,21.46 68.34,21.59 68.34,20.95
N$42
  cutout Bottom: 87.66,103.4 85.95,101.69 87.66,99.98 89.38,101.69
N$43
  Bottom 0.254: 53.61,21.46 53.35,21.59 53.35,20.95
N$44
  Bottom 0.254: 164.35,72.14 164.1,72.26 164.1,71.63
N$45
  Bottom 0.254: 146.7,72.01 146.44,72.14 146.44,71.5
N$46
  cutout Bottom: 91.37,103.76 89.65,105.47 91.37,107.18 93.08,105.47
N$47
  cutout Bottom: 95.15,99.98 93.44,101.69 95.15,103.4 96.86,101.69
N$48
  cutout Bottom: 98.85,103.76 97.14,105.47 98.85,107.18 100.57,105.47
N$49
  cutout Bottom: 98.93,96.19 97.22,97.91 98.93,99.62 100.64,97.91
N$50
  cutout Bottom: 113.83,103.76 112.11,105.47 113.83,107.18 115.54,105.47
N$51
  Bottom 0.254: 106.44,38.73 106.56,38.99 105.93,38.99
N$52
  cutout Bottom: 121.31,107.18 119.6,105.47 121.31,103.76 123.02,105.47
N$53
  cutout Bottom: 117.69,95.84 115.97,94.12 116,94.1 119.37,94.1 119.4,94.12
N$54
  Bottom 0.254: 59.45,38.73 59.57,38.99 58.94,38.99
N$55
  pour Bottom: 162.05,80.72 162.04,81.35 162.41,81.94 162.88,82.19 163.3,82.27 163.9,82.22 164.48,81.88 164.81,81.34 164.86,80.57 164.59,80.15 164.12,79.73 163.81,80.01 164.29,80.48 164.42,80.98 164.24,81.5 163.49,81.7 162.98,81.64 162.59,81.28 162.55,80.78 162.65,80.51 162.94,80.31 162.64,79.95 162.31,80.19
N$58
  Bottom 0.254: 24.01,97.92 23.76,98.04 23.76,97.41
N$60
  Bottom 0.254: 35.83,23.24 35.83,22.73 34.81,22.73 34.56,22.86 34.94,23.24 | 35.83,23.24 35.83,23.62 34.94,23.62 34.68,23.37 34.94,23.24 | 34.94,23.24 35.83,23.24 | 35.83,23.24 34.94,23.24
N$61
  pour Bottom: 111.23,30.39 111.23,27.86 111.9,27.19 112.6,27.19 113.02,27.7 114.21,27.07 114.21,28.2 113.47,28.38 113.47,29.59 112.78,29.59 112.5,28.41 112.03,28.54 112.03,29.79 114.21,29.79 114.21,30.93 111.63,30.96
N$62
  Top 0.61: U7.11 U7.10
N$63
  Top 0.61: U4.2 101.71,18.77 103.16,17.32 103.16,10.44 101.33,8.61 U4.6
N$65
  Bottom 0.254: 37.35,20.19 38.49,20.19 38.49,20.7 | 38.49,20.7 37.6,20.7 38.49,20.7 | 38.49,20.7 38.49,21.08 37.35,21.08
N$67
  Bottom 0.254: 117.07,28.81 116.26,27.55
N$70
  pour Bottom: 111.04,14.82 111.04,14.37 111.6,14.37 111.85,13.98 112.38,13.98 112.56,14.49 114.13,14.49 114.13,15.44 111.61,15.39
N$84
  pour Bottom: 111.75,13.74 111.75,12.76 114.15,12.76 114.15,13.69
N$85
  Bottom 0.254: 116.26,28.82 117.1,27.57
N$88
  Bottom 0.254: 32.27,20.19 33.16,20.19 33.41,20.7 33.16,21.08 32.27,21.08
N$89
  Bottom 0.61: U4.5 99.1,11.15 98.21,12.04 98.21,22.2 99.38,23.37 108.88,23.37 109.89,24.38 109.89,29.34 101.89,37.34 50.74,37.34 47.89,40.18 47.89,42.62 44.72,45.8 44.72,48.44 41.21,51.94 U1.22
N$90
  Bottom 0.61: U7.2 88.05,16.2 U7.12 94.5,16.2 95.69,15.01 95.69,5.44 93.61,3.35 67.25,3.35 64.55,6.04 U5.8
N$91
  Bottom 0.61: U7.8 90.49,6.04 88.91,7.62 88.91,11.2 87.69,12.42 82.31,12.42 78.47,16.26 U6.12
N$92
  Top 0.61: U6.4 68.79,13.72 67.32,12.24 67.32,9.53 65.14,7.34 60.64,7.34 56.86,11.12 U5.5
N$93
  Top 0.61: U6.6 69,8.64 64.93,4.57 60.82,4.57 56.81,8.59 U5.6
N$94  (via drill 1 pad 1.3)
  Top 0.61: 21.73,91.52 22.47,90.78 22.47,88.23 25.73,84.96 U1.6 | J4.P$2 21.09,90.88 21.73,91.52 | v20.86,101.35 20.86,98.96 22.49,97.33 22.49,92.28 21.73,91.52
N$95  (via drill 1 pad 1.3)
  Top 0.61: J4.P$7 14.67,87 14.67,82.7 13.42,81.46 13.42,72.92 14.6,71.74 18.64,71.74 20.18,70.21 v22.62,70.21 22.9,69.93 25.59,69.93 U1.12
N$96  (via drill 1 pad 1.3)
  Top 0.61: U1.11 23.53,72.26 v22.59,73.2 22.31,73.2 18.63,76.89 18.63,79.63 15.58,82.68 15.58,85.93 16.42,86.77 J4.P$8
N$98  (via drill 1 pad 1.3)
  Top 0.61: U1.9 24.45,77.34 v22.59,79.2 22.59,79.65 20.03,82.22 J4.P$5
N$99  (via drill 1 pad 1.3)
  Top 0.61: J4.P$4 21.3,85.39 22.16,84.53 22.16,82.83 25.11,79.88 U1.8
  Bottom 0.61: v26.81,101.35 25.18,99.72 24.19,99.72 22.9,98.42 22.9,88.29 20.03,85.42 J4.P$4
N$100  (via drill 1 pad 1.3)
  Top 0.61: J4.P$3 21.27,88.14 23.11,86.3 23.11,84.22 24.9,82.42 U1.7
  Bottom 0.61: v23.84,101.35 23.84,101.1 21.83,99.1 21.83,89.94 J4.P$3
N$101  (via drill 1 pad 1.3)
  Top 0.61: U1.10 23.99,74.8 v22.59,76.2 22.13,76.2 19.85,78.49 19.85,80.26 17.18,82.93 J4.P$9
N$102  (via drill 1 pad 1.3)
  Top 0.61: J3.P$2 20.28,58.83 22.47,61.01 22.47,64.92 22.62,64.77 | 22.62,64.77 v22.62,67.18 | U1.14 22.74,64.64 22.62,64.77
N$103  (via drill 1 pad 1.3)
  Top 0.61: J3.P$3 19.98,56.16 22.13,58.32 22.13,59.44 24.93,62.23 25.67,62.23 U1.15
  Bottom 0.61: v23.61,19.46 27.01,22.86 27.01,36.98 29.83,39.8 29.83,58.62 26.35,62.1 | 26.35,62.1 U1.15 26.35,62.1
N$104  (via drill 1 pad 1.3)
  Top 0.61: J3.P$4 22.19,55.55 22.19,56.46 23.25,57.53 23.25,58.42 24.52,59.69 25.67,59.69 U1.16
  Bottom 0.61: v23.61,31.52 25.49,33.4 25.49,45.01 21.96,48.54 21.96,51.51 20.13,53.34 J3.P$4
N$105  (via drill 1 pad 1.3)
  Top 0.61: J3.P$5 19.98,50.67 22.11,52.81 22.11,53.85 23.2,54.94 23.2,55.83 24.4,57.02 U1.17
  Bottom 0.61: v23.61,27.53 20.36,30.79 20.36,50.22 J3.P$5
N$106  (via drill 1 pad 1.3)
  Top 0.61: U1.21 39.25,49.4 25.44,35.59 v23.61,35.59 21.32,37.87 21.32,39.85 19.59,41.58 15.58,41.58 13.22,43.94 13.22,49 8.11,54.1 8.11,59.16 9.16,60.2 J3.P$6
N$107  (via drill 1 pad 1.3)
  Top 0.61: J3.P$7 14.77,55.09 14.77,49.15 17.87,46.05 18.73,46.05 20.33,44.45 20.33,42.88 v23.61,39.6 25.21,39.6 27.95,42.34 27.95,48.26 26.81,49.4 U1.20
N$108  (via drill 1 pad 1.3)
  Top 0.61: U1.19 24.57,51.94 23.61,50.98 23.61,47.27 | 23.61,47.27 23.61,46.99 v23.61,43.54 | J3.P$8 15.76,53.34 15.76,50.29 18.78,47.27 23.61,47.27
N$109  (via drill 1 pad 1.3)
  Top 0.61: J3.P$9 17.79,51.31 17.79,49.91 19.11,48.59 20.69,48.59 22.31,50.22 22.31,51.49 23.38,52.55 23.38,53.49 24.37,54.48 U1.18
  Bottom 0.61: v23.61,23.52 19.06,28.07 19.06,48.26 17.13,50.19 J3.P$9
N$112
  pour Bottom: 111.66,18.92 111.66,16.33 112.11,15.89 113.79,15.89 114.16,16.26 114.16,19.13 113.77,19.52 112.24,19.52
N$114
  pour Bottom: 111.24,13.8 111.18,12.76 111.49,12.76 111.49,13.8
N$117
  pour Bottom: 113.75,19.75 111.27,19.75 111.28,20.82 111.69,20.82 111.69,22.66 112.14,23.11 113.77,23.11 114.13,22.75 114.13,20.13
N$126
  cutout Bottom: 113.49,20.75 112.45,20.75 112.48,22.27 113.49,22.27
N$130
  Bottom 0.254: 117.07,25.76 116.28,24.97
N$132
  cutout Bottom: 113.44,16.95 112.47,16.95 112.5,18.47 113.44,18.47
N$147
  Bottom 0.254: 117.03,26.56 116.28,26.56
N$148
  Bottom 0.254: 116.28,26.56 117.07,25.76
N$149
  Bottom 0.254: 116.28,24.97 117.03,24.97
N$150
  Bottom 0.254: 116.73,24.01 116.73,23.12
N$151
  Bottom 0.254: 116.23,22.42 116.23,21.29
N$152
  Bottom 0.254: 116.23,21.29 116.65,21.29
N$153
  Bottom 0.254: 116.65,21.29 116.83,22.37
N$154
  Bottom 0.254: 116.83,22.37 117.12,22.37
N$155
  Bottom 0.254: 117.12,22.37 117.12,21.29
N$157
  Bottom 0.254: 116.4,20.33 116.08,19.88
N$158
  Bottom 0.254: 116.08,19.88 117.13,19.88
N$159
  cutout Bottom: 109.99,99.98 108.27,101.69 109.99,103.4 111.7,101.69
N$160
  Bottom 0.254: 117.1,18.83 117.1,17.55
N$161
  Bottom 0.254: 117.1,17.55 116.16,17.55
N$162
  Bottom 0.254: 116.16,17.55 116.14,18.83
N$168
  Bottom 0.254: 116.67,13.99 116.67,12.99
N$174
  cutout Bottom: 121.37,26.06 119.66,24.35 121.37,22.64 123.08,24.35
N$178
  cutout Bottom: 121.3,18.43 119.59,16.72 121.3,15.01 123.01,16.72
N$182
  cutout Bottom: 128.93,22.64 127.22,24.35 128.93,26.07 130.65,24.35
N$187
  cutout Bottom: 124.26,21.4 123.44,20.57 125.15,18.86 126.86,20.57 126.04,21.4
N$190
  cutout Bottom: 125.15,26.42 123.44,28.13 124.4,29.1 125.9,29.1 126.86,28.13
N$200
  cutout Bottom: 46.24,10.56 44.53,12.28 46.24,13.99 47.95,12.28
N$203
  cutout Bottom: 50.09,14.41 48.38,16.13 50.09,17.84 51.8,16.13
N$209
  cutout Bottom: 27.27,6.71 25.56,8.43 27.27,10.14 28.99,8.43
N$213
  cutout Bottom: 42.39,6.71 40.68,8.43 42.39,10.14 44.1,8.43
N$225
  cutout Bottom: 42.53,14.41 42.03,14.92 43.74,16.63 44.25,16.13
N$228
  cutout Bottom: 27.42,14.41 26.36,15.47 28.08,17.18 29.13,16.13
N$231
  cutout Bottom: 46.26,18.14 45.75,18.65 47.46,20.36 47.97,19.85
N$237
  cutout Bottom: 38.68,10.56 36.97,12.28 38.68,13.99 40.4,12.28
N$240
  cutout Bottom: 16.01,10.56 14.3,12.28 16.01,13.99 17.72,12.28
N$242
  cutout Bottom: 23.55,3.55 21.84,5.26 23.55,6.97 25.26,5.26
N$243
  cutout Bottom: 34.83,6.71 33.12,8.43 34.83,10.14 36.55,8.43
N$247
  cutout Bottom: 31.13,10.56 29.41,12.28 31.13,13.99 32.84,12.28
N$255
  cutout Bottom: 23.57,13.99 21.85,12.28 23.57,10.56 25.28,12.28
N$257
  cutout Bottom: 19.72,6.71 18,8.43 19.72,10.14 21.43,8.43
N$260
  cutout Bottom: 19.86,17.84 18.15,16.13 19.86,14.41 21.57,16.13
N$262
  cutout Bottom: 16.01,3.55 14.3,5.26 16.01,6.97 17.72,5.26
N$266
  cutout Bottom: 6.46,23.83 5.04,22.42 5.04,25.25
N$267
  cutout Bottom: 31.09,3.55 29.38,5.26 31.09,6.97 32.8,5.26
N$271
  cutout Bottom: 38.63,3.55 36.92,5.26 38.63,6.97 40.34,5.26
N$275
  cutout Bottom: 8.45,13.99 6.74,12.28 8.45,10.56 10.17,12.28
N$276
  cutout Bottom: 46.17,6.97 44.45,5.26 46.17,3.55 47.88,5.26
N$280
  cutout Bottom: 49.73,7.11 48.01,8.82 49.73,10.53 51.44,8.82
N$282
  cutout Bottom: 19.86,22.12 18.15,23.83 18.61,24.3 20.32,22.58
N$285
  cutout Bottom: 12.16,6.71 10.45,8.43 12.16,10.14 13.87,8.43
N$288
  cutout Bottom: 12.3,17.84 10.59,16.13 12.3,14.41 14.02,16.13
N$294
  cutout Bottom: 5.04,17.54 5.04,14.71 6.46,16.13
N$300
  cutout Bottom: 16.01,21.7 14.3,19.98 14.78,19.5 16.49,21.21
N$302
  cutout Bottom: 12.3,22.12 10.59,23.83 12.3,25.55 14.02,23.83
N$307
  cutout Bottom: 8.45,21.7 6.74,19.98 8.45,18.27 10.17,19.98
N$311
  cutout Bottom: 12.3,29.83 10.59,31.54 12.3,33.25 14.02,31.54
N$315
  cutout Bottom: 8.45,25.98 6.74,27.69 8.45,29.4 10.17,27.69
N$318
  cutout Bottom: 5.04,32.96 5.04,30.12 6.46,31.54
N$321
  cutout Bottom: 12.3,37.53 10.59,39.25 12.3,40.96 14.02,39.25
N$325
  cutout Bottom: 8.45,33.68 6.74,35.39 8.45,37.11 10.17,35.39
N$329
  cutout Bottom: 5.04,40.15 5.04,37.31 6.46,38.73
N$332
  cutout Bottom: 14.74,43.55 14.3,43.1 16.01,41.39 16.46,41.83
N$335
  cutout Bottom: 5.04,47.77 5.04,44.93 6.46,46.35
N$338
  cutout Bottom: 8.45,48.28 6.74,49.99 8.45,51.7 10.17,49.99
N$342
  cutout Bottom: 6.46,53.61 5.04,52.19 5.04,55.02
N$352
  cutout Bottom: 8.45,41.12 6.74,42.83 7.44,43.53 7.44,46.92 11.06,46.92 12.3,48.15 14.02,46.44 12.3,44.73 11.98,44.33 11.98,41.8 9.52,41.8
N$353
  cutout Bottom: 113.77,96.19 112.06,97.91 113.77,99.62 115.48,97.91
N$354
  pour Bottom: 162.5,86.82 161.99,86.82 162.07,88.54 164.66,88.54 164.66,86.71 164.35,86.71 164.35,87.9 163.54,87.9 163.54,86.88 163.09,86.88 163.09,87.88 162.5,87.88
N$355
  cutout Bottom: 106.21,103.76 104.49,105.47 106.21,107.18 107.92,105.47
N$356
  pour Bottom: 111.72,26.93 111.68,23.99 112.09,23.57 114.09,23.57 114.23,23.72 114.23,26.59 113.91,26.91 113.07,26.91 112.59,26.42 112.59,24.7 112.36,24.7 112.36,26.93
  cutout Bottom: 113.53,24.67 113.14,24.67 113.22,25.93 113.53,25.93
N$357
  pour Bottom: 112.05,9.04 111.62,9.47 111.62,12.48 114.13,12.46 114.13,11.43 112.42,11.43 112.42,10.18 112.68,9.93 114.15,9.93 114.15,9.04
N$358
  pour Bottom: 164.32,85.8 162.13,85.8 162.13,86.4 164.69,86.4 164.69,84.72 164.32,84.72
N$359
  pour Bottom: 162.13,84.38 162.08,82.81 162.64,82.81 162.64,83.83 163.22,83.83 163.22,82.76 163.7,82.76 163.7,83.84 164.44,83.84 164.44,82.72 164.75,82.72 164.75,84.38
N$360
  cutout Bottom: 121.3,10.81 119.59,9.1 121.3,7.39 123.01,9.1
N$361
  cutout Bottom: 128.93,15.02 127.22,16.73 128.93,18.45 130.65,16.73
N$362
  cutout Bottom: 125.12,11.21 123.41,12.92 125.12,14.64 126.84,12.92
N$363
  Bottom 0.254: 191.27,72.14 190.89,72.14 | 190.89,72.14 190.51,72.14 190.89,72.14 | 190.89,72.14 190.89,72.52 190.89,71.75
PNUM
  Bottom 0.254: 116.14,18.83 117.1,18.83
SND  (via drill 1 pad 1.3)
  Top 0.61: J2.P$2 51.12,40.95 49.54,39.37 49.54,30.48 v51.98,28.04
  Bottom 0.61: XC1.P$2 189.32,40.95 188.35,41.91 179.59,41.91 178.32,40.64 111.01,40.64 109.32,42.33 103.43,42.33 102.14,41.05 J1.P$2 96.13,41.05 94.96,42.21 55.68,42.21 54.42,40.95 J2.P$2 | v51.98,28.04 39.79,15.85 35.34,15.85 Q1.3
VCC  (via drill 1 pad 1.3)  (1 unrouted)
  Top 0.61: XC1.P$25 204.05,71.27 C8.+ 182.21,71.27 C9.2 181.34,70.71 U2.20 173.19,70.92 173.19,73.66 | C2.2 173.19,73.66 | L1.1 141.26,71.88 v141.34,71.81 143.19,73.66 155.82,73.66 | 155.82,73.66 173.19,73.66 | 105.27,71.5 J1.P$25 125.11,71.53 XX03.P$1 130.69,71.91 L1.2 | U7.14 93.13,25.38 C7.2 | J2.P$25 61.94,71.42 68.21,65.15 68.21,39.24 78.12,29.34 C6.2 78.12,21.49 U6.14 | R1.2 36.64,27.41 36.64,39.67 v40.02,43.05 44.74,47.78 44.74,58.27 43.45,59.56 U1.25 | U4.14 108.11,21.69 C4.2 108.11,25.88 115.25,33.02 C10.2 XX03.P$2 | C5.2 62.98,21.31 U5.14 | C3.2 155.87,73.71 | 155.87,73.71 155.82,73.66 | U3.20 155.84,73.69 155.87,73.71
  Bottom 0.61: C4.2 105.6,27.99 95.54,27.99 C7.2 90.61,27.89 80.53,27.89 C6.2 75.83,27.76 65.26,27.76 C5.2 54.39,34.06 48.37,34.06 40.02,42.42 v40.02,43.05 | U1.25 42.02,59.56 43.9,61.44 43.9,64.62 43.9,67.18 U1.28 43.93,67.18 43.93,95.86 42.12,97.66 U1.40 41.03,99.44 37.88,102.59 C1.1 | U4.14 104.15,21.31 | 104.15,21.31 U4.1 | U4.4 104.15,16.97 104.15,21.31 | C2.2 173.19,70.92 U2.20 | C3.2 155.87,70.66 U3.20 | J2.P$25 94.3,71.42 95.44,70.28 101.56,70.28 102.81,71.53 J1.P$25
Φ
  Top 0.61: U4.3 99.35,16.23 97.29,18.29 97.29,37.41 95.87,38.84 95.87,46.99 97.55,48.67 J1.P$8
  Bottom 0.61: XC1.P$8 180.2,48.56 175.88,44.25 114.34,44.25 108.65,49.94 103.01,49.94 101.74,48.67 J1.P$8 96.19,48.67 95.02,49.84 55.71,49.84 54.44,48.56 J2.P$8

### Text on the board
tPlace: Aquarius Mini Expander v1-1-0 / Rev B - 02 SEP 2020 / by Sean Harrington, sph@1stage.com